# Altium project MODULIQ_TDC.PrjPcb
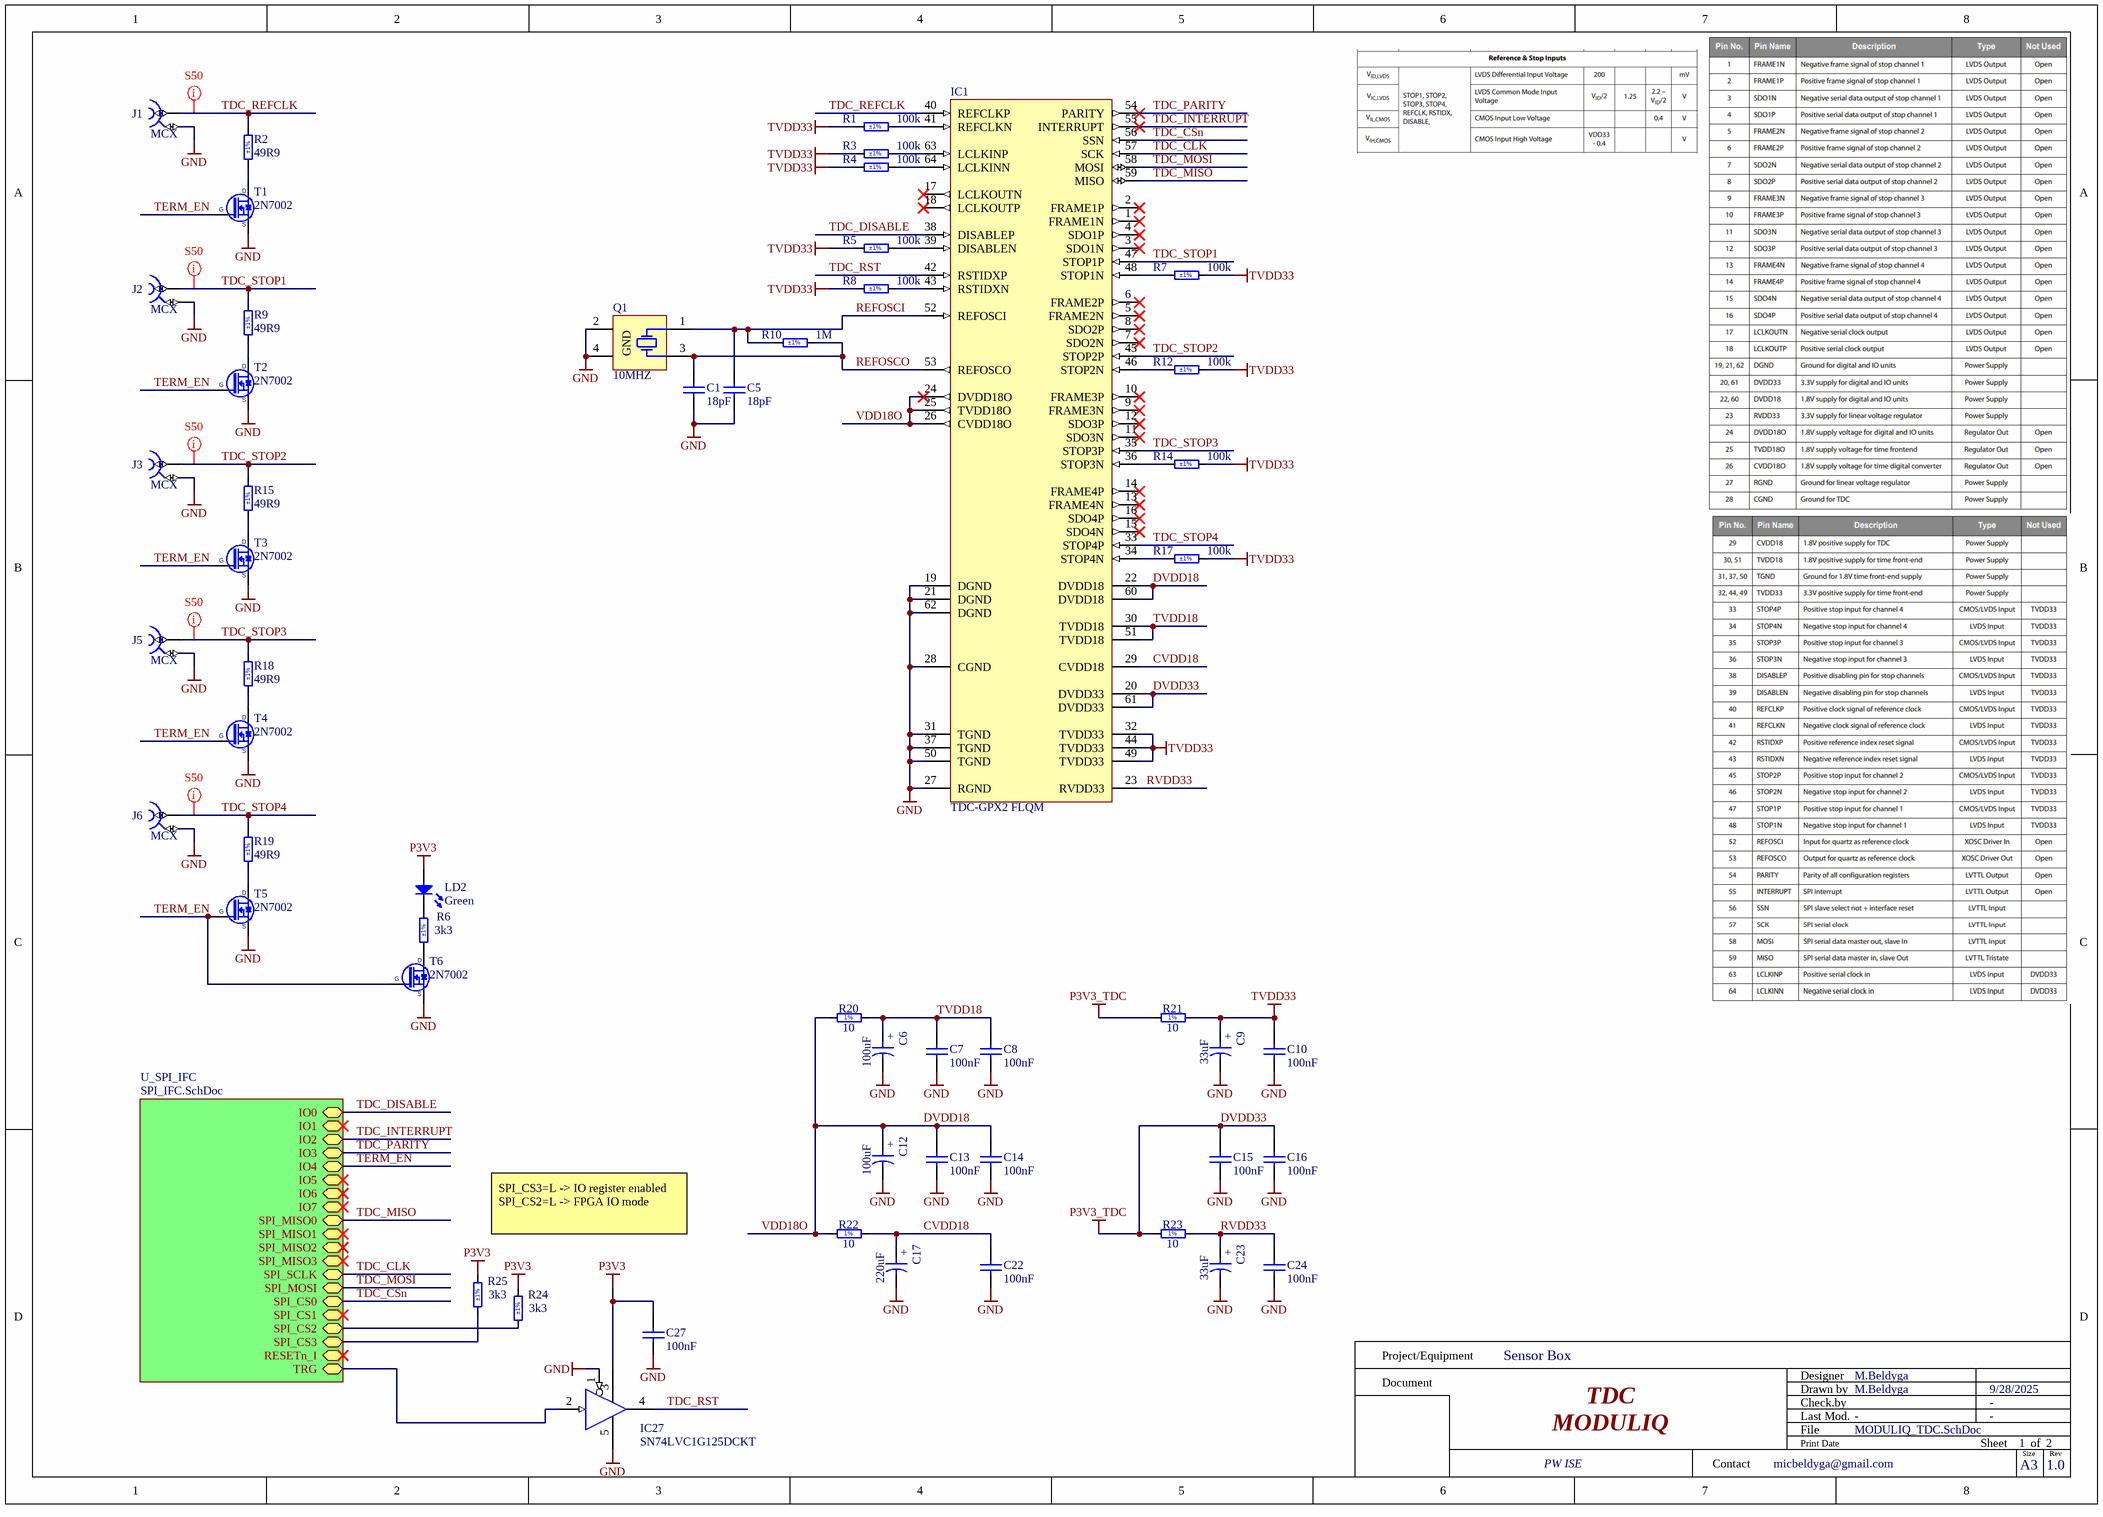
[diagram p0: MODULIQ_TDC.SchDoc]
CreateDate: 9/28/2025; ProjectName: TDC; Revision: 1.0
2 sheets, 110 parts. Net scope: hierarchical (ports join the sheet entries above them; power ports are global).
Board file: MODULIQ_TDC.PcbDoc
Sheets:
  MODULIQ_TDC.SchDoc
    U_SPI_IFC = SPI_IFC.SchDoc

## Sheet MODULIQ_TDC.SchDoc: TDC
size A3; Author: M.Beldyga; CompanyName: WUT ISE; DrawnBy: M.Beldyga; Organization: WUT ISE; Address1: PW ISE; Address2: Nowowiejska 15/19 00-665 Warsaw; Address3: micbeldyga@gmail.com; SheetNumber: 1; SheetTotal: 2; ModifiedBy: -; CheckedDate: -; Title2: MODULIQ; DivGrp: WUT ISE; Designer: M.Beldyga; ModifiedDate: -; ProjectName: Sensor Box

### Parts
C1  18pF  [CAPC1005X55N]
C5  18pF  [CAPC1005X55N]
C6  100uF  [CAPMP3216X180N]
C7  100nF  [CAPC1005X55N]
C8  100nF  [CAPC1005X55N]
C9  33uF  [CAPMP3216X180N]
C10  100nF  [CAPC1005X55N]
C12  100uF  [CAPMP3216X180N]
C13  100nF  [CAPC1005X55N]
C14  100nF  [CAPC1005X55N]
C15  100nF  [CAPC1005X55N]
C16  100nF  [CAPC1005X55N]
C17  220uF  [CAPMP3528X210N]
C22  100nF  [CAPC1005X55N]
C23  33uF  [CAPMP3216X180N]
C24  100nF  [CAPC1005X55N]
C27  100nF  [CAPC1005X55N]
IC1  TDC-GPX2 FLQM  [QFP50P1200X1200X160-64N]
IC27  SN74LVC1G125DCKT  [SOT65P210X110-5N]
J1  MCX  [AMPHENOL_919-109J-51PX]
J2  MCX  [AMPHENOL_919-109J-51PX]
J3  MCX  [AMPHENOL_919-109J-51PX]
J5  MCX  [AMPHENOL_919-109J-51PX]
J6  MCX  [AMPHENOL_919-109J-51PX]
LD2  Green  [LED_KINGBRIGHT_KP-1608CGCK]
Q1  10MHZ  [XTAL_ABRACON_ABMM2]
R1  100k  Tolerance: ±1%  [RESC1005X40N]
R2  49R9  Tolerance: ±1%  [RESC3225X70N]
R3  100k  Tolerance: ±1%  [RESC1005X40N]
R4  100k  Tolerance: ±1%  [RESC1005X40N]
R5  100k  Tolerance: ±1%  [RESC1005X40N]
R6  3k3  Tolerance: ±1%  [RESC1005X40N]
R7  100k  Tolerance: ±1%  [RESC1005X40N]
R8  100k  Tolerance: ±1%  [RESC1005X40N]
R9  49R9  Tolerance: ±1%  [RESC3225X70N]
R10  1M  Tolerance: ±1%  [RESC1005X40N]
R12  100k  Tolerance: ±1%  [RESC1005X40N]
R14  100k  Tolerance: ±1%  [RESC1005X40N]
R15  49R9  Tolerance: ±1%  [RESC3225X70N]
R17  100k  Tolerance: ±1%  [RESC1005X40N]
R18  49R9  Tolerance: ±1%  [RESC3225X70N]
R19  49R9  Tolerance: ±1%  [RESC3225X70N]
R20  10  [RESC1005X40N]
R21  10  [RESC1005X40N]
R22  10  [RESC1005X40N]
R23  10  [RESC1005X40N]
R24  3k3  Tolerance: ±1%  [RESC1005X40N]
R25  3k3  Tolerance: ±1%  [RESC1005X40N]
T1  2N7002  [SOT95P240X130-3N]
T2  2N7002  [SOT95P240X130-3N]
T3  2N7002  [SOT95P240X130-3N]
T4  2N7002  [SOT95P240X130-3N]
T5  2N7002  [SOT95P240X130-3N]
T6  2N7002  [SOT95P240X130-3N]

### Sub-sheets
U_SPI_IFC = SPI_IFC.SchDoc: IO0 (bidir), IO1 (bidir), IO2 (bidir), IO3 (bidir), IO4 (bidir), IO5 (bidir), IO6 (bidir), IO7 (bidir), SPI_MISO0 (bidir), SPI_MISO1 (bidir), SPI_MISO2 (bidir), SPI_MISO3 (bidir), SPI_SCLK (bidir), SPI_MOSI (bidir), SPI_CS0 (bidir), SPI_CS1 (bidir), SPI_CS2 (bidir), SPI_CS3 (bidir), RESETn_I (bidir), TRG (bidir)

### Nets
DVDD33: C15.2 C16.2 IC1.20(DVDD33) IC1.61(DVDD33) R21.1 R23.1  [also labelled P3V3_TDC]
GND: C1.1 C5.1 C6.2 C7.1 C8.1 C9.2 C10.1 C12.2 C13.1 C14.1 C15.1 C16.1 C17.2 C22.1 C23.2 C24.1 C27.1 IC1.19(DGND) IC1.21(DGND) IC1.27(RGND) IC1.28(CGND) IC1.31(TGND) IC1.37(TGND) IC1.50(TGND) IC1.62(DGND) IC27.1(~{G}) IC27.5(VCC) J1.2 J2.2 J3.2 J5.2 J6.2 Q1.2(GND) Q1.4(GND) T1.2(S) T2.2(S) T3.2(S) T4.2(S) T5.2(S) T6.2(S)
P3V3: C27.2 IC27.3(GND) LD2.2(A) R24.1 R25.1
TVDD33: C9.1 C10.2 IC1.32(TVDD33) IC1.44(TVDD33) IC1.49(TVDD33) R1.2 R3.2 R4.2 R5.2 R7.2 R8.2 R12.2 R14.2 R17.2 R21.2
CVDD18: C17.1 C22.2 IC1.29(CVDD18) R22.2
DVDD18: C12.1 C13.2 C14.2 IC1.22(DVDD18) IC1.24(DVDD18O) IC1.25(TVDD18O) IC1.26(CVDD18O) IC1.60(DVDD18) R20.1 R22.1  [also labelled VDD18O]
REFOSCI: C5.2 IC1.52(REFOSCI) Q1.1(X) R10.2
REFOSCO: C1.2 IC1.53(REFOSCO) Q1.3(X) R10.1
RVDD33: C23.1 C24.2 IC1.23(RVDD33) R23.2
SPI_CS2: R24.2 ; sheet U_SPI_IFC/SPI_CS2
SPI_CS3: R25.2 ; sheet U_SPI_IFC/SPI_CS3
TDC_CLK: IC1.57(SCK) ; sheet U_SPI_IFC/SPI_SCLK  [project net SPI_SCLK]
TDC_CSn: IC1.56(SSN) ; sheet U_SPI_IFC/SPI_CS0  [project net SPI_CS0]
TDC_DISABLE: IC1.38(DISABLEP) ; sheet U_SPI_IFC/IO0  [project net IO0]
TDC_INTERRUPT: IC1.55(INTERRUPT) ; sheet U_SPI_IFC/IO2  [project net IO2]
TDC_MISO: IC1.59(MISO) ; sheet U_SPI_IFC/SPI_MISO0  [project net SPI_MISO0]
TDC_MOSI: IC1.58(MOSI) ; sheet U_SPI_IFC/SPI_MOSI  [project net SPI_MOSI]
TDC_PARITY: IC1.54(PARITY) ; sheet U_SPI_IFC/IO3  [project net IO3]
TDC_REFCLK: IC1.40(REFCLKP) J1.1 R2.2
TDC_RST: IC1.42(RSTIDXP) IC27.4(OUT)
TDC_STOP1: IC1.47(STOP1P) J2.1 R9.2
TDC_STOP2: IC1.45(STOP2P) J3.1 R15.2
TDC_STOP3: IC1.35(STOP3P) J5.1 R18.2
TDC_STOP4: IC1.33(STOP4P) J6.1 R19.2
TERM_EN: T1.1(G) T2.1(G) T3.1(G) T4.1(G) T5.1(G) T6.1(G) ; sheet U_SPI_IFC/IO4  [project net IO4]
TRG: IC27.2(IN) ; sheet U_SPI_IFC/TRG
TVDD18: C6.1 C7.2 C8.2 IC1.30(TVDD18) IC1.51(TVDD18) R20.2
NetIC1_34: IC1.34(STOP4N) R17.1
NetIC1_36: IC1.36(STOP3N) R14.1
NetIC1_39: IC1.39(DISABLEN) R5.1
NetIC1_41: IC1.41(REFCLKN) R1.1
NetIC1_43: IC1.43(RSTIDXN) R8.1
NetIC1_46: IC1.46(STOP2N) R12.1
NetIC1_48: IC1.48(STOP1N) R7.1
NetIC1_63: IC1.63(LCLKINP) R3.1
NetIC1_64: IC1.64(LCLKINN) R4.1
NetLD2_1: LD2.1(C) R6.1
NetR2_1: R2.1 T1.3(D)
NetR6_2: R6.2 T6.3(D)
NetR9_1: R9.1 T2.3(D)
NetR15_1: R15.1 T3.3(D)
NetR18_1: R18.1 T4.3(D)
NetR19_1: R19.1 T5.3(D)

Not connected (* = marked no-connect by the designer): IC1 1(FRAME1N)* 2(FRAME1P)* 3(SDO1N)* 4(SDO1P)* 5(FRAME2N)* 6(FRAME2P)* 7(SDO2N)* 8(SDO2P)* 9(FRAME3N)* 10(FRAME3P)* 11(SDO3N)* 12(SDO3P)* 13(FRAME4N)* 14(FRAME4P)* 15(SDO4N)* 16(SDO4P)* 17(LCLKOUTN)* 18(LCLKOUTP)*

### Layout directives
net class S50: TDC_REFCLK
net class S50; net class TDC_IN: TDC_STOP1, TDC_STOP2, TDC_STOP3, TDC_STOP4

### Notes on the sheet
- SPI_CS3=L -> IO register enabled
  SPI_CS2=L -> FPGA IO mode
- Project/Equipment
- Document
- Designer
- Drawn by
- Check.by
- Contact
- File
- Last Mod.
- Print Date
- Sheet
- Size
- A3
- of
- Rev
- (in symbol CTE3216-18_33UF_4V_10%) +
- (in symbol CTE3216-18_100UF_6.3V_20%_ESR0500_AVX_TLJ) +
- (in symbol CTE3528-21_220UF_2.5V_10%) +
- (in symbol R0402_10R_1%_0.0625W_200PPM) 1%

### Library data of the parts
C1 C5 = CC0402_18PF_50V_5%_C0G: Non-polarised capacitor; Part Description: SMD Multilayer Chip Ceramic Capacitor; Manufacturer: GENERIC; Manufacturer1 Part Number: C0402C180J5GACTU; Voltage: 50V; TC: C0G/NP0; Tolerance: ±5%; Part Number: CC0402_18PF_50V_5%_C0G; Component Kind: Standard; Component Type: Standard; Pin Count: 2; Value: 18pF; Status: Preferred; Manufacturer Part Number: CC0402_18PF_50V_5%_C0G; Case: 0402; Mounted: Yes; Socket: No; SMD: Yes; Sense: No; Manufacturer1 Example: KEMET; Manufacturer1 ComponentHeight: 0.55mm; HelpURL: \\cern.ch\dfs\Applications\Altium\Datasheets\CC0402_C0G_KEMET_(Commercial Grade).pdf; Author: CERN DEM JLC; CreateDate: 10/4/2016; LatestRevisionDate: 10/4/2016
C6 C12 = CTE3216-18_100UF_6.3V_20%_ESR0500_AVX_TLJ: Polarised capacitor; Part Description: ESR 0R5 Solid Tantalum Chip Capacitor; Manufacturer: AVX; Manufacturer Part Number: TLJA107M006R0500; Voltage: 6.3V; Tolerance: ±20%; Part Number: CTE3216-18_100UF_6.3V_20%_ESR0500_AVX_TLJ; Component Kind: Standard; Component Type: Standard; Pin Count: 2; Value: 100uF; Status: None; Case: A; Mounted: Yes; Socket: No; SMD: Yes; Sense: No; ComponentHeight: 1.8mm; HelpURL: \\cern.ch\dfs\Applications\Altium\Datasheets\CTE_AVX_TLJ.pdf; Author: CERN DEM JLC; CreateDate: 19.12.2013; LatestRevisionDate: 19.12.2013
C7 C8 C10 C13-C16 C22 C24 C27 = CC0402_100NF_50V_10%_X7R: Non-polarised capacitor; Part Description: SMD Multilayer Chip Ceramic Capacitor; Manufacturer: GENERIC; Manufacturer1 Part Number: GRM155R71H104KE14D; Voltage: 50V; TC: X7R; Tolerance: ±10%; Part Number: CC0402_100NF_50V_10%_X7R; Component Kind: Standard; Component Type: Standard; Pin Count: 2; Value: 100nF; Status: None; Manufacturer Part Number: CC0402_100NF_50V_10%_X7R; Case: 0402; Mounted: Yes; Socket: No; SMD: Yes; Sense: No; Manufacturer1 Example: MURATA; Manufacturer1 ComponentHeight: 0.55mm; HelpURL: \\cern.ch\dfs\Applications\Altium\Datasheets\CC0402_MURATA_GRM155R71H104KE14D.pdf; Author: CERN DEM MR; CreateDate: 6/30/2017; LatestRevisionDate: 6/30/2017
C9 C23 = CTE3216-18_33UF_4V_10%: Polarised capacitor; Part Description: Solid Tantalum Chip Capacitor; Manufacturer: GENERIC; Manufacturer1 Part Number: TAJA336K004R; Voltage: 4V; Tolerance: ±10%; Part Number: CTE3216-18_33UF_4V_10%; Component Kind: Standard; Component Type: Standard; Pin Count: 2; Value: 33uF; Status: Preferred; Manufacturer Part Number: CTE3216-18_33UF_4V_10%; Case: A; Mounted: Yes; Socket: No; SMD: Yes; Sense: No; Manufacturer1 Example: AVX; Manufacturer1 ComponentHeight: 1.8mm; HelpURL: \\cern.ch\dfs\Applications\Altium\Datasheets\CTE_AVX_TAJ.pdf; Author: CERN DEM JLC; CreateDate: 03.12.2007; LatestRevisionDate: 03.12.2007
C17 = CTE3528-21_220UF_2.5V_10%: Polarised capacitor; Part Description: Solid Tantalum Chip Capacitor; Manufacturer: GENERIC; Manufacturer1 Part Number: TAJB227K002R; Voltage: 2.5V; Tolerance: ±10%; Part Number: CTE3528-21_220UF_2.5V_10%; Component Kind: Standard; Component Type: Standard; Pin Count: 2; Value: 220uF; Status: Preferred; Manufacturer Part Number: CTE3528-21_220UF_2.5V_10%; Case: B; Mounted: Yes; Socket: No; SMD: Yes; Sense: No; Manufacturer1 Example: AVX; Manufacturer1 ComponentHeight: 2.1mm; HelpURL: \\cern.ch\dfs\Applications\Altium\Datasheets\CTE_AVX_TAJ.pdf; Author: CERN DEM JLC; CreateDate: 03.12.2007; LatestRevisionDate: 03.12.2007
IC1 = TDC-GPX2: 4 Channel Time to Digital Converter; Manufacturer: AMS; PressFit: No; Bonding: No; Part Number: TDC-GPX2; Component Kind: Standard; Component Type: Standard; Device: TDC-GPX2 FLQM; PackageDescription: QFP, 0.50mm Pitch, Square; 64 Pin, 10.0mm L X 10.0mm W X 1.60mm H Body, IPC Medium Density; Part Description: 4 Channel Time to Digital Converter; Manufacturer Part Number: TDC-GPX2 FLQM; Pin Count: 64; Case: QFP64; Mounted: Yes; Socket: No; SMD: Yes; Sense: No; ComponentHeight: 1.6mm; Author: CERN DEM MR; HelpURL: \\cern.ch\dfs\Applications\Altium\Datasheets\AMS_TDC-GPX2.pdf; CreateDate: 4/23/2019; LatestRevisionDate: 4/5/2024
IC27 = SN74LVC1G125DCKT: Single Bus Buffer Gate With 3-State Output; Part Description: Single Bus Buffer Gate With 3-State Outputs; Manufacturer: TEXAS INSTRUMENTS; PressFit: No; Bonding: No; Part Number: SN74LVC1G125DCKT; Component Kind: Standard; Component Type: Standard; Device: SN74LVC1G125DCKT; PackageDescription: SOT353, SC70-5, SOT, 0.65mm Pitch, 5 pin, 1.25mm W X 2.00mm L X 1.10mm H, IPC Medium Density; Manufacturer Part Number: SN74LVC1G125DCKT; Pin Count: 5; Case: SOT353; Mounted: Yes; Socket: No; SMD: Yes; Sense: No; ComponentHeight: 1.1mm; Author: CERN DEM JLC; HelpURL: \\cern.ch\dfs\Applications\Altium\Datasheets\SN74LVC1G125DCKT.pdf; CreateDate: 12/19/2011; LatestRevisionDate: 12/19/2011
J1-J3 J5 J6 = AMPHENOL_919-109J-51PX: Part Description: 50 Ohms, RF Connector, MCX Straight PCB Receptacle Jack; Manufacturer Part Number: 919-109J-51PX (MCX6251B1-3GT30G-50); PressFit: No; Part Number: AMPHENOL_919-109J-51PX; Component Kind: Standard; Component Type: Standard; Pin Count: 5; Family: MCX; Mounted: Yes; Socket: No; SMD: No; Sense: No; Status: None; Manufacturer: AMPHENOL; ComponentHeight: 6.06mm; HelpURL: \\cern.ch\dfs\Applications\Altium\Datasheets\AMPHENOL_919-109J-51PX.pdf; Author: CERN DEM BC; CreateDate: 31.01.2019; LatestRevisionDate: 31.01.2019
LD2 = LED_KINGBRIGHT_KP-1608CGCK: LED Green 1C 2A; Part Description: 1.6x0.8mm SMD Chip Green LED Lamp; PressFit: No; Bonding: No; Part Number: LED_KINGBRIGHT_KP-1608CGCK; Component Kind: Standard; Component Type: Standard; Color: Green; PackageDescription: SMT Green LED, Case 0603, Body L 1.60mm x W 0.80mm x H 1.10mm; Manufacturer: KINGBRIGHT; Manufacturer Part Number: KP-1608CGCK; Pin Count: 2; Case: 0603; Mounted: Yes; Socket: No; SMD: Yes; Sense: No; ComponentHeight: 1.1mm; HelpURL: \\cern.ch\dfs\Applications\Altium\Datasheets\LED_KINGBRIGHT_KP-1608CGCK.pdf; Author: CERN DEM HF; CreateDate: 10/1/2021; LatestRevisionDate: 10/1/2021
Q1 = XTAL_10MHZ_ABRACON_ABMM2-10.000MHZ-E2-T: Crystal 4 pins 1=XTAL Control 2=GND3=XTAL 4=GND; Part Description: Tolerance: ±20ppm, -20°C to +70°C, 18pF, SMD Crystal, ABMM2 Series; PressFit: No; Bonding: No; Part Number: XTAL_10MHZ_ABRACON_ABMM2-10.000MHZ-E2-T; Component Kind: Standard; Component Type: Standard; PackageDescription: 4 Pins,  6mm L X 3.5mm H, SMD Low Profile Crystal, ABMM2 Serie; Value: 10MHZ; Manufacturer: ABRACON; Manufacturer Part Number: ABMM2-10.000MHZ-E2-T; Pin Count: 4; Mounted: Yes; Socket: No; SMD: Yes; Sense: No; ComponentHeight: 1.2mm; HelpURL: \\cern.ch\dfs\Applications\Altium\Datasheets\XTAL_ABRACON_ABMM2.pdf; Author: CERN DEM MR; CreateDate: 12/10/2015; LatestRevisionDate: 12/10/2015
R1 R3-R5 R7 R8 R12 R14 R17 = R0402_100K_1%_0.0625W_100PPM: Resistor - 1%; Part Description: General Purpose Thick Film Chip Resistor; Manufacturer: GENERIC; Manufacturer1 Part Number: 232270671004L; TC: ±100ppm/°C; PressFit: No; Part Number: R0402_100K_1%_0.0625W_100PPM; Component Kind: Standard; Component Type: Standard; Pin Count: 2; Value: 100k; Status: Not Recommended; Power: 0.0625W; Manufacturer Part Number: R0402_100K_1%_0.0625W_100PPM; Case: 0402; Mounted: Yes; Sense: No; Socket: No; SMD: Yes; Manufacturer1 Example: YAGEO PHYCOMP; Manufacturer1 ComponentHeight: 0.4mm; HelpURL: \\cern.ch\dfs\Applications\Altium\Datasheets\R0402_Phycomp_RC0402.pdf; Author: CERN DEM JLC; CreateDate: 12/3/2007; LatestRevisionDate: 10/17/2012
R2 R9 R15 R18 R19 = R1210_49R9_1%_0.5W_100PPM_VISHAY_CRCW: Resistor - 1%; Part Description: Thick Film Chip Resistor; Manufacturer: VISHAY DRALORIC; Manufacturer Part Number: CRCW121049R9FK; Power: 0.5W; TC: ±100ppm/°C; PressFit: No; Part Number: R1210_49R9_1%_0.5W_100PPM_VISHAY_CRCW; Component Kind: Standard; Component Type: Standard; Pin Count: 2; Value: 49R9; Status: None; Case: 1210; Mounted: Yes; Sense: No; Socket: No; SMD: Yes; ComponentHeight: 0.7mm; HelpURL: \\cern.ch\dfs\Applications\Altium\Datasheets\R1210_VISHAY_CRCW1210.pdf; Author: CERN DEM JMW; CreateDate: 8/6/2014; LatestRevisionDate: 8/6/2014
R6 R24 R25 = R0402_3K3_1%_0.0625W_100PPM: Resistor - 1%; Part Description: General Purpose Thick Film Chip Resistor; Manufacturer: GENERIC; Manufacturer1 Part Number: 232270673302L; TC: ±100ppm/°C; PressFit: No; Part Number: R0402_3K3_1%_0.0625W_100PPM; Component Kind: Standard; Component Type: Standard; Pin Count: 2; Value: 3k3; Status: Not Recommended; Power: 0.0625W; Manufacturer Part Number: R0402_3K3_1%_0.0625W_100PPM; Case: 0402; Mounted: Yes; Sense: No; Socket: No; SMD: Yes; Manufacturer1 Example: YAGEO PHYCOMP; Manufacturer1 ComponentHeight: 0.4mm; HelpURL: \\cern.ch\dfs\Applications\Altium\Datasheets\R0402_Phycomp_RC0402.pdf; Author: CERN DEM JLC; CreateDate: 03.12.2007; LatestRevisionDate: 17.10.2012
R10 = R0402_1M_1%_0.0625W_100PPM: Resistor - 1%; Part Description: General Purpose Thick Film Chip Resistor; Manufacturer: GENERIC; Manufacturer1 Part Number: 232270671005L; TC: ±100ppm/°C; PressFit: No; Part Number: R0402_1M_1%_0.0625W_100PPM; Component Kind: Standard; Component Type: Standard; Pin Count: 2; Value: 1M; Status: Not Recommended; Power: 0.0625W; Manufacturer Part Number: R0402_1M_1%_0.0625W_100PPM; Case: 0402; Mounted: Yes; Sense: No; Socket: No; SMD: Yes; Manufacturer1 Example: YAGEO PHYCOMP; Manufacturer1 ComponentHeight: 0.4mm; HelpURL: \\cern.ch\dfs\Applications\Altium\Datasheets\R0402_Phycomp_RC0402.pdf; Author: CERN DEM JLC; CreateDate: 12/3/2007; LatestRevisionDate: 10/17/2012
R20-R23 = R0402_10R_1%_0.0625W_200PPM: Resistor - 1%; Part Description: General Purpose Thick Film Chip Resistor; Manufacturer: GENERIC; Manufacturer1 Part Number: 232270671009L; TC: ±200ppm/°C; PressFit: No; Part Number: R0402_10R_1%_0.0625W_200PPM; Component Kind: Standard; Component Type: Standard; Pin Count: 2; Value: 10; Status: Not Recommended; Power: 0.0625W; Tolerance: ±1%; Manufacturer Part Number: R0402_10R_1%_0.0625W_200PPM; Case: 0402; Mounted: Yes; Sense: No; Socket: No; SMD: Yes; Manufacturer1 Example: YAGEO PHYCOMP; Manufacturer1 ComponentHeight: 0.4mm; HelpURL: \\cern.ch\dfs\Applications\Altium\Datasheets\R0402_Phycomp_RC0402.pdf; Author: CERN DEM JLC; CreateDate: 24.06.2009; LatestRevisionDate: 17.10.2012
T1-T6 = 2N7002: N-CHANNEL MOSFET WITH DIODE; Part Description: 60V, 280mA, N-Channel Enhancement Mode Field Effect Transistor (FET); Manufacturer: FAIRCHILD SEMICONDUCTOR; PressFit: No; Bonding: No; Part Number: 2N7002; Component Kind: Standard; Component Type: Standard; Device: 2N7002; PackageDescription: SOT23, 0.95mm Pitch; 3 Pin, 1.30mm W X 2.90mm L X 1.30mm H body, IPC Medium Density; Manufacturer Part Number: 2N7002; Pin Count: 3; Case: SOT23-3; Mounted: Yes; Socket: No; SMD: Yes; Sense: No; ComponentHeight: 1.3mm; HelpURL: \\cern.ch\dfs\Applications\Altium\Datasheets\2N7002.pdf; Author: CERN DEM JLC; CreateDate: 8/20/2008; LatestRevisionDate: 4/7/2009

## Sheet SPI_IFC.SchDoc: Title
size 420 x 297 mm; Author: G.Kasprowicz; CompanyName: WUT ISE; DrawnBy: G.Kasprowicz; Organization: WUT ISE; Address1: PW ISE; Address2: Nowowiejska 15/19 00-665 Warsaw; Address3: gkasprow@gmail.com; Revision: 1.0; SheetNumber: 2; SheetTotal: 2; ModifiedBy: -; CheckedDate: -; Title2: Title2; DivGrp: WUT ISE; Designer: G.Kasprowicz; SPICEModelCacheRYPVXPCY: <root> / <DocumentId>RYPVXPCY</DocumentId> / </root>; ModifiedDate: -; ProjectName: Sensor Box
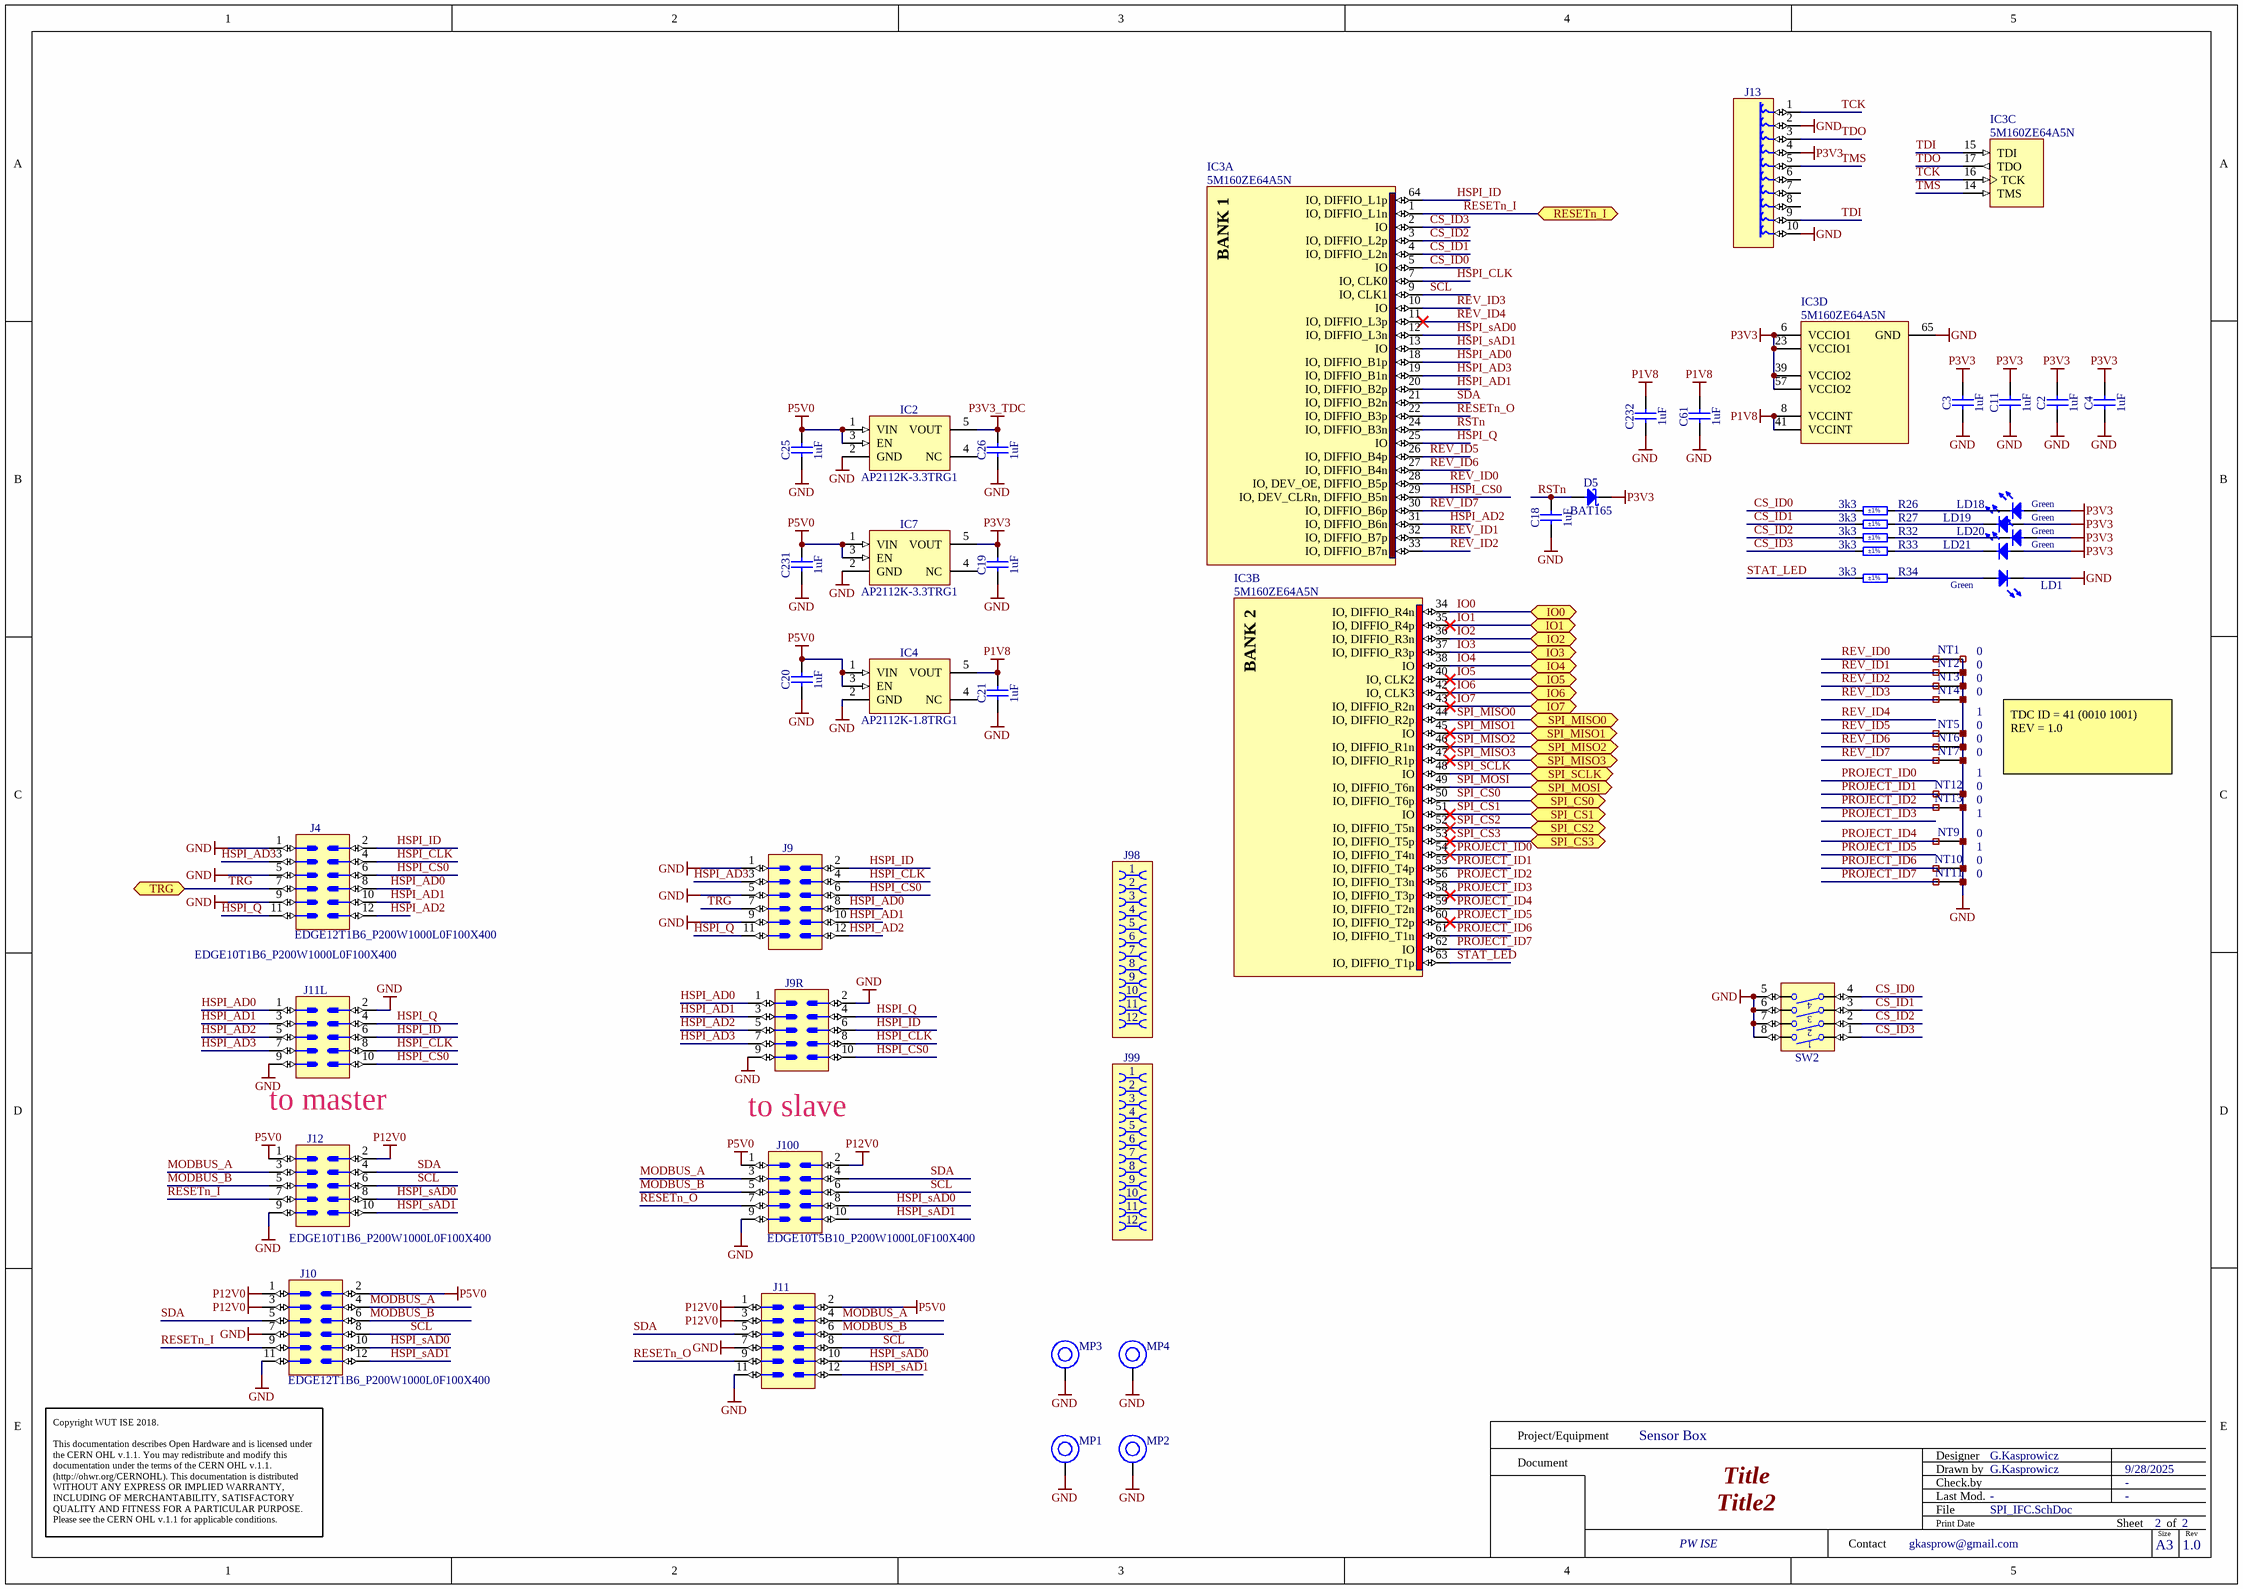
[diagram p1: SPI_IFC.SchDoc]

### Parts
C2  1uF  [CAPC1005X55N]
C3  1uF  [CAPC1005X55N]
C4  1uF  [CAPC1005X55N]
C11  1uF  [CAPC1005X55N]
C18  1uF  [CAPC1005X55N]
C19  1uF  [CAPC1005X55N]
C20  1uF  [CAPC1005X55N]
C21  1uF  [CAPC1005X55N]
C25  1uF  [CAPC1005X55N]
C26  1uF  [CAPC1005X55N]
C61  1uF  [CAPC1005X55N]
C231  1uF  [CAPC1005X55N]
C232  1uF  [CAPC1005X55N]
D5  BAT165  [SOD2512X110N]
IC2  AP2112K-3.3TRG1  [SOT95P285X140-5N]
IC3  5M160ZE64A5N  [QFP40P900X900X120-65N-S550]  (parts A,B,C,D of 4)
IC4  AP2112K-1.8TRG1  [SOT95P285X140-5N]
IC7  AP2112K-3.3TRG1  [SOT95P285X140-5N]
J4  (no value)  [EDGE12T1B6_P200W1000L0F100X400]
J9  (no value)  [EDGE12T5B10_P200W1000L0F100X400]
J9R  (no value)  [EDGE10T5B10_P200W1000L0F100X400]
J10  (no value)  [EDGE12T1B6_P200W1000L0F100X400]
J11  (no value)  [EDGE12T5B10_P200W1000L0F100X400]
J11L  (no value)  [EDGE10T1B6_P200W1000L0F100X400]
J12  (no value)  [EDGE10T1B6_P200W1000L0F100X400]
J13  TC2050-IDC  [TC2050-IDC]  (value not drawn)
J98  (no value)  [AVX_009159012761916]
J99  (no value)  [AVX_009159012761916]
J100  (no value)  [EDGE10T5B10_P200W1000L0F100X400]
LD1  Green  [LED_KINGBRIGHT_KP-1608CGCK]
LD18  Green  [LED_KINGBRIGHT_KP-1608CGCK]
LD19  Green  [LED_KINGBRIGHT_KP-1608CGCK]
LD20  Green  [LED_KINGBRIGHT_KP-1608CGCK]
LD21  Green  [LED_KINGBRIGHT_KP-1608CGCK]
MP1  M1.6 x 3mm  [97730306330]  (value not drawn)
MP2  M1.6 x 3mm  [97730306330]  (value not drawn)
MP3  M1.6 x 3mm  [97730306330]  (value not drawn)
MP4  M1.6 x 3mm  [97730306330]  (value not drawn)
NT1  Net Tie  [Net Tie 3]  (value not drawn)  (net tie, no BOM)
NT2  Net Tie  [Net Tie 3]  (value not drawn)  (net tie, no BOM)
NT3  Net Tie  [Net Tie 3]  (value not drawn)  (net tie, no BOM)
NT4  Net Tie  [Net Tie 3]  (value not drawn)  (net tie, no BOM)
NT5  Net Tie  [Net Tie 3]  (value not drawn)  (net tie, no BOM)
NT6  Net Tie  [Net Tie 3]  (value not drawn)  (net tie, no BOM)
NT7  Net Tie  [Net Tie 3]  (value not drawn)  (net tie, no BOM)
NT9  Net Tie  [Net Tie 3]  (value not drawn)  (net tie, no BOM)
NT10  Net Tie  [Net Tie 3]  (value not drawn)  (net tie, no BOM)
NT11  Net Tie  [Net Tie 3]  (value not drawn)  (net tie, no BOM)
NT12  Net Tie  [Net Tie 3]  (value not drawn)  (net tie, no BOM)
NT13  Net Tie  [Net Tie 3]  (value not drawn)  (net tie, no BOM)
R26  3k3  Tolerance: ±1%  [RESC1005X40N]
R27  3k3  Tolerance: ±1%  [RESC1005X40N]
R32  3k3  Tolerance: ±1%  [RESC1005X40N]
R33  3k3  Tolerance: ±1%  [RESC1005X40N]
R34  3k3  Tolerance: ±1%  [RESC1005X40N]
SW2  Switch  [SW_OMRON_A6H-4102]  (value not drawn)

### Ports
IO0 (bidir), IO1 (bidir), IO2 (bidir), IO3 (bidir), IO4 (bidir), IO5 (bidir), IO6 (bidir), IO7 (bidir), RESETn_I (bidir), SPI_CS0 (bidir), SPI_CS1 (bidir), SPI_CS2 (bidir), SPI_CS3 (bidir), SPI_MISO0 (bidir), SPI_MISO1 (bidir), SPI_MISO2 (bidir), SPI_MISO3 (bidir), SPI_MOSI (bidir), SPI_SCLK (bidir), TRG (bidir)

### Nets
GND: C2.1 C3.1 C4.1 C11.1 C18.1 C19.1 C20.1 C21.1 C25.1 C26.1 C61.1 C231.1 C232.1 IC2.2(GND) IC3.65(GND) IC4.2(GND) IC7.2(GND) J4.1 J4.5 J4.9 J9.1 J9.5 J9.9 J9R.2 J9R.9 J10.7 J10.11 J11.7 J11.11 J11L.2 J11L.9 J12.9 J13.2 J13.10 J100.9 LD1.1(C) MP1.1 MP2.1 MP3.1 MP4.1 NT1.2 NT2.2 NT3.2 NT4.2 NT5.2 NT6.2 NT7.2 NT9.2 NT10.2 NT11.2 NT12.2 NT13.2 SW2.5 SW2.6 SW2.7 SW2.8
P1V8: C21.2 C61.2 C232.2 IC3.8(VCCINT) IC3.41(VCCINT) IC4.5(VOUT)
P3V3: C2.2 C3.2 C4.2 C11.2 C19.2 D5.1(C) IC3.6(VCCIO1) IC3.23(VCCIO1) IC3.39(VCCIO2) IC3.57(VCCIO2) IC7.5(VOUT) J13.4 LD18.2(A) LD19.2(A) LD20.2(A) LD21.2(A)
P3V3_TDC: C26.2 IC2.5(VOUT)  [project net DVDD33]
P5V0: C20.2 C25.2 C231.2 IC2.1(VIN) IC2.3(EN) IC4.1(VIN) IC4.3(EN) IC7.1(VIN) IC7.3(EN) J10.2 J11.2 J12.1 J100.1
P12V0: J10.1 J10.3 J11.1 J11.3 J12.2 J100.2
CS_ID0: IC3.5(IO) R26.2 SW2.4
CS_ID1: IC3.4(IO,_DIFFIO_L2n) R27.2 SW2.3
CS_ID2: IC3.3(IO,_DIFFIO_L2p) R32.2 SW2.2
CS_ID3: IC3.2(IO) R33.2 SW2.1
HSPI_AD0: IC3.18(IO,_DIFFIO_B1p) J4.8 J9.8 J9R.1 J11L.1
HSPI_AD1: IC3.20(IO,_DIFFIO_B2p) J4.10 J9.10 J9R.3 J11L.3
HSPI_AD2: IC3.31(IO,_DIFFIO_B6n) J4.12 J9.12 J9R.5 J11L.5
HSPI_AD3: IC3.19(IO,_DIFFIO_B1n) J4.3 J9.3 J9R.7 J11L.7
HSPI_CLK: IC3.7(IO,_CLK0) J4.4 J9.4 J9R.8 J11L.8
HSPI_CS0: IC3.29(IO,_DEV_CLRn,_DIFFIO_B5n) J4.6 J9.6 J9R.10 J11L.10
HSPI_ID: IC3.64(IO,_DIFFIO_L1p) J4.2 J9.2 J9R.6 J11L.6
HSPI_Q: IC3.25(IO) J4.11 J9.11 J9R.4 J11L.4
HSPI_sAD0: IC3.12(IO,_DIFFIO_L3n) J10.10 J11.10 J12.8 J100.8
HSPI_sAD1: IC3.13(IO) J10.12 J11.12 J12.10 J100.10
IO0: IC3.34(IO,_DIFFIO_R4n) ; port IO0
IO1: IC3.35(IO,_DIFFIO_R4p) ; port IO1
IO2: IC3.36(IO,_DIFFIO_R3n) ; port IO2
IO3: IC3.37(IO,_DIFFIO_R3p) ; port IO3
IO4: IC3.38(IO) ; port IO4
IO5: IC3.40(IO,_CLK2) ; port IO5
IO6: IC3.42(IO,_CLK3) ; port IO6
IO7: IC3.43(IO,_DIFFIO_R2n) ; port IO7
MODBUS_A: J10.4 J11.4 J12.3 J100.3
MODBUS_B: J10.6 J11.6 J12.5 J100.5
PROJECT_ID0: IC3.54(IO,_DIFFIO_T4n)
PROJECT_ID1: IC3.55(IO,_DIFFIO_T4p) NT12.1
PROJECT_ID2: IC3.56(IO,_DIFFIO_T3n) NT13.1
PROJECT_ID3: IC3.58(IO,_DIFFIO_T3p)
PROJECT_ID4: IC3.59(IO,_DIFFIO_T2n) NT9.1
PROJECT_ID5: IC3.60(IO,_DIFFIO_T2p)
PROJECT_ID6: IC3.61(IO,_DIFFIO_T1n) NT10.1
PROJECT_ID7: IC3.62(IO) NT11.1
RESETn_I: IC3.1(IO,_DIFFIO_L1n) J10.9 J12.7 ; port RESETn_I
RESETn_O: IC3.22(IO,_DIFFIO_B3p) J11.9 J100.7
REV_ID0: IC3.28(IO,_DEV_OE,_DIFFIO_B5p) NT1.1
REV_ID1: IC3.32(IO,_DIFFIO_B7p) NT2.1
REV_ID2: IC3.33(IO,_DIFFIO_B7n) NT3.1
REV_ID3: IC3.10(IO) NT4.1
REV_ID4: IC3.11(IO,_DIFFIO_L3p)
REV_ID5: IC3.26(IO,_DIFFIO_B4p) NT5.1
REV_ID6: IC3.27(IO,_DIFFIO_B4n) NT6.1
REV_ID7: IC3.30(IO,_DIFFIO_B6p) NT7.1
RSTn: C18.2 D5.2(A) IC3.24(IO,_DIFFIO_B3n)
SCL: IC3.9(IO,_CLK1) J10.8 J11.8 J12.6 J100.6
SDA: IC3.21(IO,_DIFFIO_B2n) J10.5 J11.5 J12.4 J100.4
SPI_CS0: IC3.50(IO,_DIFFIO_T6p) ; port SPI_CS0
SPI_CS1: IC3.51(IO) ; port SPI_CS1
SPI_CS2: IC3.52(IO,_DIFFIO_T5n) ; port SPI_CS2
SPI_CS3: IC3.53(IO,_DIFFIO_T5p) ; port SPI_CS3
SPI_MISO0: IC3.44(IO,_DIFFIO_R2p) ; port SPI_MISO0
SPI_MISO1: IC3.45(IO) ; port SPI_MISO1
SPI_MISO2: IC3.46(IO,_DIFFIO_R1n) ; port SPI_MISO2
SPI_MISO3: IC3.47(IO,_DIFFIO_R1p) ; port SPI_MISO3
SPI_MOSI: IC3.49(IO,_DIFFIO_T6n) ; port SPI_MOSI
SPI_SCLK: IC3.48(IO) ; port SPI_SCLK
STAT_LED: IC3.63(IO,_DIFFIO_T1p) R34.2
TCK: IC3.16(TCK) J13.1
TDI: IC3.15(TDI) J13.9
TDO: IC3.17(TDO) J13.3
TMS: IC3.14(TMS) J13.5
TRG: J4.7 J9.7 ; port TRG
NetLD1_2: LD1.2(A) R34.1
NetLD18_1: LD18.1(C) R26.1
NetLD19_1: LD19.1(C) R27.1
NetLD20_1: LD20.1(C) R32.1
NetLD21_1: LD21.1(C) R33.1

Not connected (* = marked no-connect by the designer): IC2 4(NC); IC4 4(NC); IC7 4(NC); J13 6 7 8

### Notes on the sheet
- 0
- 1
- TDC ID = 41 (0010 1001)
  REV = 1.0
- (near J11L) to master
- to slave
- Project/Equipment
- Document
- Designer
- Drawn by
- Check.by
- Copyright WUT ISE 2018.
  This documentation describes Open Hardware and is licensed under the CERN OHL v.1.1. You may redistribute and modify this documentation under the terms of the CERN OHL v.1.1. (http://ohwr.org/CERNOHL). This documentation is distributed WITHOUT ANY EXPRESS OR IMPLIED WARRANTY, INCLUDING OF MERCHANTABILITY, SATISFACTORY QUALITY AND FITNESS FOR A PARTICULAR PURPOSE. Please see the CERN OHL v.1.1 for applicable conditions.
- Contact
- File
- Last Mod.
- Print Date
- Sheet
- Size
- A3
- of
- Rev
- (in symbol 5M160ZE64A5N, part A) BANK 1
- (in symbol 5M160ZE64A5N, part B) BANK 2
- (in symbol AVX_009159012761916) 11

### Library data of the parts
C2-C4 C11 C18-C21 C25 C26 C61 C231 C232 = CC0402_1UF_16V_10%_X5R: Non-polarised capacitor; Part Description: SMD Multilayer Chip Ceramic Capacitor; Manufacturer: GENERIC; Manufacturer1 Part Number: C1005X5R1C105KT; Voltage: 16V; TC: X5R; Tolerance: ±10%; Part Number: CC0402_1UF_16V_10%_X5R; Component Kind: Standard; Component Type: Standard; Pin Count: 2; Value: 1uF; Status: Preferred; Manufacturer Part Number: CC0402_1UF_16V_10%_X5R; Case: 0402; Mounted: Yes; Socket: No; SMD: Yes; Sense: No; Manufacturer1 Example: TDK; Manufacturer1 ComponentHeight: 0.55mm; HelpURL: \\cern.ch\dfs\Applications\Altium\Datasheets\CC0402_X5R_TDK_C.pdf; Author: CERN DEM JLC; CreateDate: 25.10.2012; LatestRevisionDate: 25.10.2012
D5 = BAT165: Schottky Diode; Part Description: Medium Power AF Schottky Diode; Manufacturer: INFINEON; Voltage: 40V; Power: 750mA; PressFit: No; Bonding: No; Part Number: BAT165; Component Kind: Standard; Component Type: Standard; Device: BAT165; PackageDescription: Small Outline Diode (SOD-323), 1.70mm W X 1.25mm L X 1.10mm H body,  IPC Medium Density; Manufacturer Part Number: BAT165; Pin Count: 2; Case: SOD-323; Mounted: Yes; Socket: No; SMD: Yes; Sense: No; ComponentHeight: 1.1mm; HelpURL: \\cern.ch\dfs\Applications\Altium\Datasheets\BAT165.pdf; Author: CERN DEM JLC; CreateDate: 12.11.2014; LatestRevisionDate: 12.11.2014
IC2 IC7 = AP2112K-3.3TRG1: 600mA CMOS Low Dropout Linear Regulator with Enable; Part Description: 3.3V 600mA CMOS Low Dropout Linear Regulator with Enable; Manufacturer: DIODES INCORPORATED; PressFit: No; Bonding: No; Part Number: AP2112K-3.3TRG1; Component Kind: Standard; Component Type: Standard; Device: AP2112K-3.3TRG1; PackageDescription: SOT23, 0.95mm Pitch; 5 Pin, 1.6mm W X 3.0mm L X 1.40mm H body, IPC Medium Density; Manufacturer Part Number: AP2112K-3.3; Pin Count: 5; Case: SOT25; Mounted: Yes; Socket: No; SMD: Yes; Sense: No; ComponentHeight: 1.4mm; HelpURL: \\cern.ch\dfs\Applications\Altium\Datasheets\AP2112K-3.3TRG1.pdf; Author: CERN DEM MR; CreateDate: 13.12.2017; LatestRevisionDate: 27.06.2022
IC3 = 5M160ZE64A5N: MAX V 1.8V CPLD, 54 IOs, 160 Logic Elements, 64-Pin EQFP, Automotive Temperature, Speed Grade 5, Pb-Free; Manufacturer: ALTERA; PressFit: No; Bonding: No; Part Number: 5M160ZE64A5N; Component Kind: Standard; Component Type: Standard; Device: 5M160ZE64A5N; PackageDescription: QFP, 0.40mm Pitch, Square; 64 pin, 7.00mm L X 7.00mm W X 1.20mm H body (w/Thermal Tab 5.50 X 5.50mm), IPC Medium Density; Status: Not Recommended; Part Description: MAX V 1.8V CPLD, 54 IOs, 160 Logic Elements, 64-Pin EQFP, Automotive Temperature, Speed Grade 5, Pb-Free; Manufacturer Part Number: 5M160ZE64A5N; Pin Count: 65; Case: QFP64; Mounted: Yes; Socket: No; SMD: Yes; Sense: No; ComponentHeight: 1.2mm; HelpURL: \\cern.ch\dfs\Applications\Altium\Datasheets\5M160ZE64A5N.pdf; ComponentLink1URL: \\cern.ch\dfs\Applications\Altium\Datasheets\5M160ZE64A5N_Package.pdf; ComponentLink1Description: Package Drawing; ComponentLink2URL: \\cern.ch\dfs\Applications\Altium\Datasheets\5M160ZE64A5N_Pinout.pdf; ComponentLink2Description: Pinout; Author: CERN DEM JLC; CreateDate: 07.01.2015; LatestRevisionDate: 27.10.2022
IC4 = AP2112K-1.8TRG1: 600mA CMOS Low Dropout Linear Regulator with Enable; Part Description: 1.8V 600mA CMOS Low Dropout Linear Regulator with Enable; Manufacturer: DIODES INCORPORATED; PressFit: No; Bonding: No; Part Number: AP2112K-1.8TRG1; Component Kind: Standard; Component Type: Standard; Device: AP2112K-1.8TRG1; PackageDescription: SOT23, 0.95mm Pitch; 5 Pin, 1.6mm W X 3.0mm L X 1.40mm H body, IPC Medium Density; Manufacturer Part Number: AP2112K-1.8; Pin Count: 5; Case: SOT25; Mounted: Yes; Socket: No; SMD: Yes; Sense: No; ComponentHeight: 1.4mm; HelpURL: \\cern.ch\dfs\Applications\Altium\Datasheets\AP2112K-1.8TRG1.pdf; Author: CERN DEM JLC; CreateDate: 13.06.2018; LatestRevisionDate: 27.06.2022
J4 J10 = PCB Edge Connector 12 (2x6): Part Number: EDGE10T1B6_P200W1000L0F100X400; Part Description: 10 Contacts Board Edge Connector, Pitch 2mm, Length 0mm, Width 10mm, Finger Lenght 4mm, Finger Width 1mm; Mounted: No; PressFit: No; Component Kind: Standard (No BOM); Component Type: Standard (No BOM); Pin Count: 12; Socket: No; SMD: No; Sense: No; Status: None; ComponentHeight: 0mm; HelpURL: \\cern.ch\dfs\Applications\Altium\Datasheets\EDGE10T1B6_P200W1000L0F100X400.pdf; Author: CERN DEM MR; CreateDate: 14.02.2018; LatestRevisionDate: 14.02.2018
J9 J11 = PCB Edge Connector 12 (2x6) R: PCB Edge Connector 12 (2x6); Part Description: 12 Contacts Board Edge Connector, Pitch 2mm, Length 0mm, Width 10mm, Finger Lenght 4mm, Finger Width 1mm; Mounted: No; PressFit: No; Part Number: EDGE12T5B10_P200W1000L0F100X400; Component Kind: Standard (No BOM); Component Type: Standard (No BOM); Pin Count: 12; Socket: No; SMD: No; Sense: No; Status: None; ComponentHeight: 0mm; HelpURL: \\cern.ch\dfs\Applications\Altium\Datasheets\EDGE10T5B10_P200W1000L0F100X400.pdf; Author: GK; CreateDate: 14.02.2018; LatestRevisionDate: 14.02.2018
J9R J100 = EDGE10T5B10_P200W1000L0F100X400: PCB Edge Connector 10 (2x5); Part Description: 10 Contacts Board Edge Connector, Pitch 2mm, Length 0mm, Width 10mm, Finger Lenght 4mm, Finger Width 1mm; Mounted: No; PressFit: No; Part Number: EDGE10T5B10_P200W1000L0F100X400; Component Kind: Standard (No BOM); Component Type: Standard (No BOM); Pin Count: 10; Socket: No; SMD: No; Sense: No; Status: None; ComponentHeight: 0mm; HelpURL: \\cern.ch\dfs\Applications\Altium\Datasheets\EDGE10T5B10_P200W1000L0F100X400.pdf; Author: CERN DEM MR; CreateDate: 14.02.2018; LatestRevisionDate: 14.02.2018
J11L J12 = EDGE10T1B6_P200W1000L0F100X400: PCB Edge Connector 10 (2x5); Part Description: 10 Contacts Board Edge Connector, Pitch 2mm, Length 0mm, Width 10mm, Finger Lenght 4mm, Finger Width 1mm; Mounted: No; PressFit: No; Part Number: EDGE10T1B6_P200W1000L0F100X400; Component Kind: Standard (No BOM); Component Type: Standard (No BOM); Pin Count: 10; Socket: No; SMD: No; Sense: No; Status: None; ComponentHeight: 0mm; HelpURL: \\cern.ch\dfs\Applications\Altium\Datasheets\EDGE10T1B6_P200W1000L0F100X400.pdf; Author: CERN DEM MR; CreateDate: 14.02.2018; LatestRevisionDate: 14.02.2018
J13 = TC2050-IDC: TC2030-MCP and TC2050-IDC Pad Contact; Part Description: 10 X 31mil Diameter SMD Pad For TC2050-IDC Legged Connector; Mounted: No; Part Number: TC2050-IDC; Component Kind: Standard (No BOM); Component Type: Standard (No BOM); Pin Count: 10; Family: TC2050-IDC; Socket: No; SMD: Yes; Sense: No; Status: None; ComponentHeight: 0mm; HelpURL: \\cern.ch\dfs\Applications\Altium\Datasheets\TC2050-IDC.pdf; Author: CERN DEM HF; CreateDate: 02.05.2024; LatestRevisionDate: 02.05.2024; PackageDescription: 10 X 31mil Diameter SMD Pad For TC2030-MCP Legged Connector
J98 J99 = AVX_009159012761916: Open Ended Card Edge Connector, 9159 Series; Part Number: AVX_0009159012761916; Part Description: 10 Contacts, 2mm Pitch, Open Ended Card Edge Connector, 9159 Series; Manufacturer: AVX; PressFit: No; Component Kind: Standard; Component Type: Standard; Pin Count: 12; Mounted: Yes; Socket: No; SMD: No; Sense: No; Status: None; Manufacturer Part Number: 009159012761916; ComponentHeight: 1.6mm; HelpURL: \\cern.ch\dfs\Applications\Altium\Datasheets\AVX_00 9159 010 061 916.pdf; Author: GK; CreateDate: 13.02.2018; LatestRevisionDate: 13.02.2018
LD1 LD18-LD21 = LED_KINGBRIGHT_KP-1608CGCK: as LD2 on sheet MODULIQ_TDC; Part Number: LED_KINGBRIGHT_KP-1608CGCK; Component Kind: Standard; Component Type: Standard; Color: Green; PackageDescription: SMT Green LED, Case 0603, Body L 1.60mm x W 0.80mm x H 1.10mm; Manufacturer: KINGBRIGHT; Manufacturer Part Number: KP-1608CGCK; Pin Count: 2; Case: 0603; Mounted: Yes; Socket: No; SMD: Yes; Sense: No; ComponentHeight: 1.1mm; HelpURL: \\cern.ch\dfs\Applications\Altium\Datasheets\LED_KINGBRIGHT_KP-1608CGCK.pdf; Author: CERN DEM HF; CreateDate: 01.10.2021; LatestRevisionDate: 01.10.2021
MP1-MP4 = 97730306330R: WA-SMSI SMT Steel Spacer with internal Thread Bottom closed, OD 3.3mm, M1.6 x 3mm; Manufacturer: Wurth Elektronik; Inside Thread Length: 1.8mm; Surface: Tin; ComponentLink1Description: Website Link; ComponentLink1URL: https://www.we-online.com/redexpert/article/97730306330R?ad; ComponentLink2Description: Datasheet Link; ComponentLink2URL: https://www.we-online.com/redexpert/spec/97730306330R?ad; Manufacturer Part Number: 97730306330R; Category: SMT Spacers; Match Code: WA-SMSI; Mount: Surface Mount; Operating Temperature Max: 150°C; Operating Temperature Min: -55°C; Packaging: Tape and Reel; Height: 3mm; Material: Steel; Outside Diameter: 3.3mm; Thread Size: M1.6
NT1-NT7 NT9-NT13 = Net Tie 3: Part Description: Net Tie (2 Nets); Mounted: No; Part Number: Net Tie 3; Component Type: Net Tie; Pin Count: 2; Family: Net Tie; Socket: No; SMD: No; Sense: No; Status: None; ComponentHeight: 0mm; HelpURL: Undefined; Author: CERN DEM HF; CreateDate: 23.09.2024; LatestRevisionDate: 23.09.2024; PackageDescription: SMD Net Tie
R26 R27 R32-R34 = R0402_3K3_1%_0.0625W_100PPM: as R6 on sheet MODULIQ_TDC; Part Number: R0402_3K3_1%_0.0625W_100PPM; Component Kind: Standard; Component Type: Standard; Pin Count: 2; Value: 3k3; Status: Not Recommended; Power: 0.0625W; Manufacturer Part Number: R0402_3K3_1%_0.0625W_100PPM; Case: 0402; Mounted: Yes; Sense: No; Socket: No; SMD: Yes; Manufacturer1 Example: YAGEO PHYCOMP; Manufacturer1 ComponentHeight: 0.4mm; HelpURL: \\cern.ch\dfs\Applications\Altium\Datasheets\R0402_Phycomp_RC0402.pdf; Author: CERN DEM JLC; CreateDate: 03.12.2007; LatestRevisionDate: 17.10.2012
SW2 = SW_OMRON_A6H-4102: 4 Ways SPST DIP Switch; Part Description: 4 Ways Ultra-low Profile, Half-pitch, SPST DIP Switch with Seal Tape, Rating 25mA 24VDC; Manufacturer: OMRON; PressFit: No; Part Number: SW_OMRON_A6H-4102; Component Kind: Standard; Component Type: Standard; Pin Count: 8; PackageDescription: Pitch 1.27mm, Body 6.31 x 4.5mm, 4 Ways SPST Surface-Mounting DIP Switch, OMRON A6H; Family: Switch; Mounted: Yes; Socket: No; SMD: Yes; Sense: No; Status: None; Manufacturer Part Number: A6H-4102; ComponentHeight: 1.45mm; HelpURL: \\cern.ch\dfs\Applications\Altium\Datasheets\SW_OMRON_A6H-4102.pdf; Author: CERN DEM JLC; CreateDate: 17.12.2013; LatestRevisionDate: 17.12.2013

## Nets that join several sheets
DVDD33: MODULIQ_TDC (6 pins), SPI_IFC (C26.2 IC2.5)
GND: MODULIQ_TDC (40 pins), SPI_IFC (56 pins)
P3V3: MODULIQ_TDC (5 pins), SPI_IFC (16 pins)
IO0: MODULIQ_TDC (IC1.38), SPI_IFC (IC3.34)
IO2: MODULIQ_TDC (IC1.55), SPI_IFC (IC3.36)
IO3: MODULIQ_TDC (IC1.54), SPI_IFC (IC3.37)
IO4: MODULIQ_TDC (6 pins), SPI_IFC (IC3.38)
SPI_CS0: MODULIQ_TDC (IC1.56), SPI_IFC (IC3.50)
SPI_CS2: MODULIQ_TDC (R24.2), SPI_IFC (IC3.52)
SPI_CS3: MODULIQ_TDC (R25.2), SPI_IFC (IC3.53)
SPI_MISO0: MODULIQ_TDC (IC1.59), SPI_IFC (IC3.44)
SPI_MOSI: MODULIQ_TDC (IC1.58), SPI_IFC (IC3.49)
SPI_SCLK: MODULIQ_TDC (IC1.57), SPI_IFC (IC3.48)
TRG: MODULIQ_TDC (IC27.2), SPI_IFC (J4.7 J9.7)